# EasyEDA schematic ESP32.json

## Sheets
1 Sheet_1: TITLE: Sheet_1; REV: 1.0; Date: 2024-03-06; Sheet: 1/1; Drawn By: javiervolpe; Company: Your Company
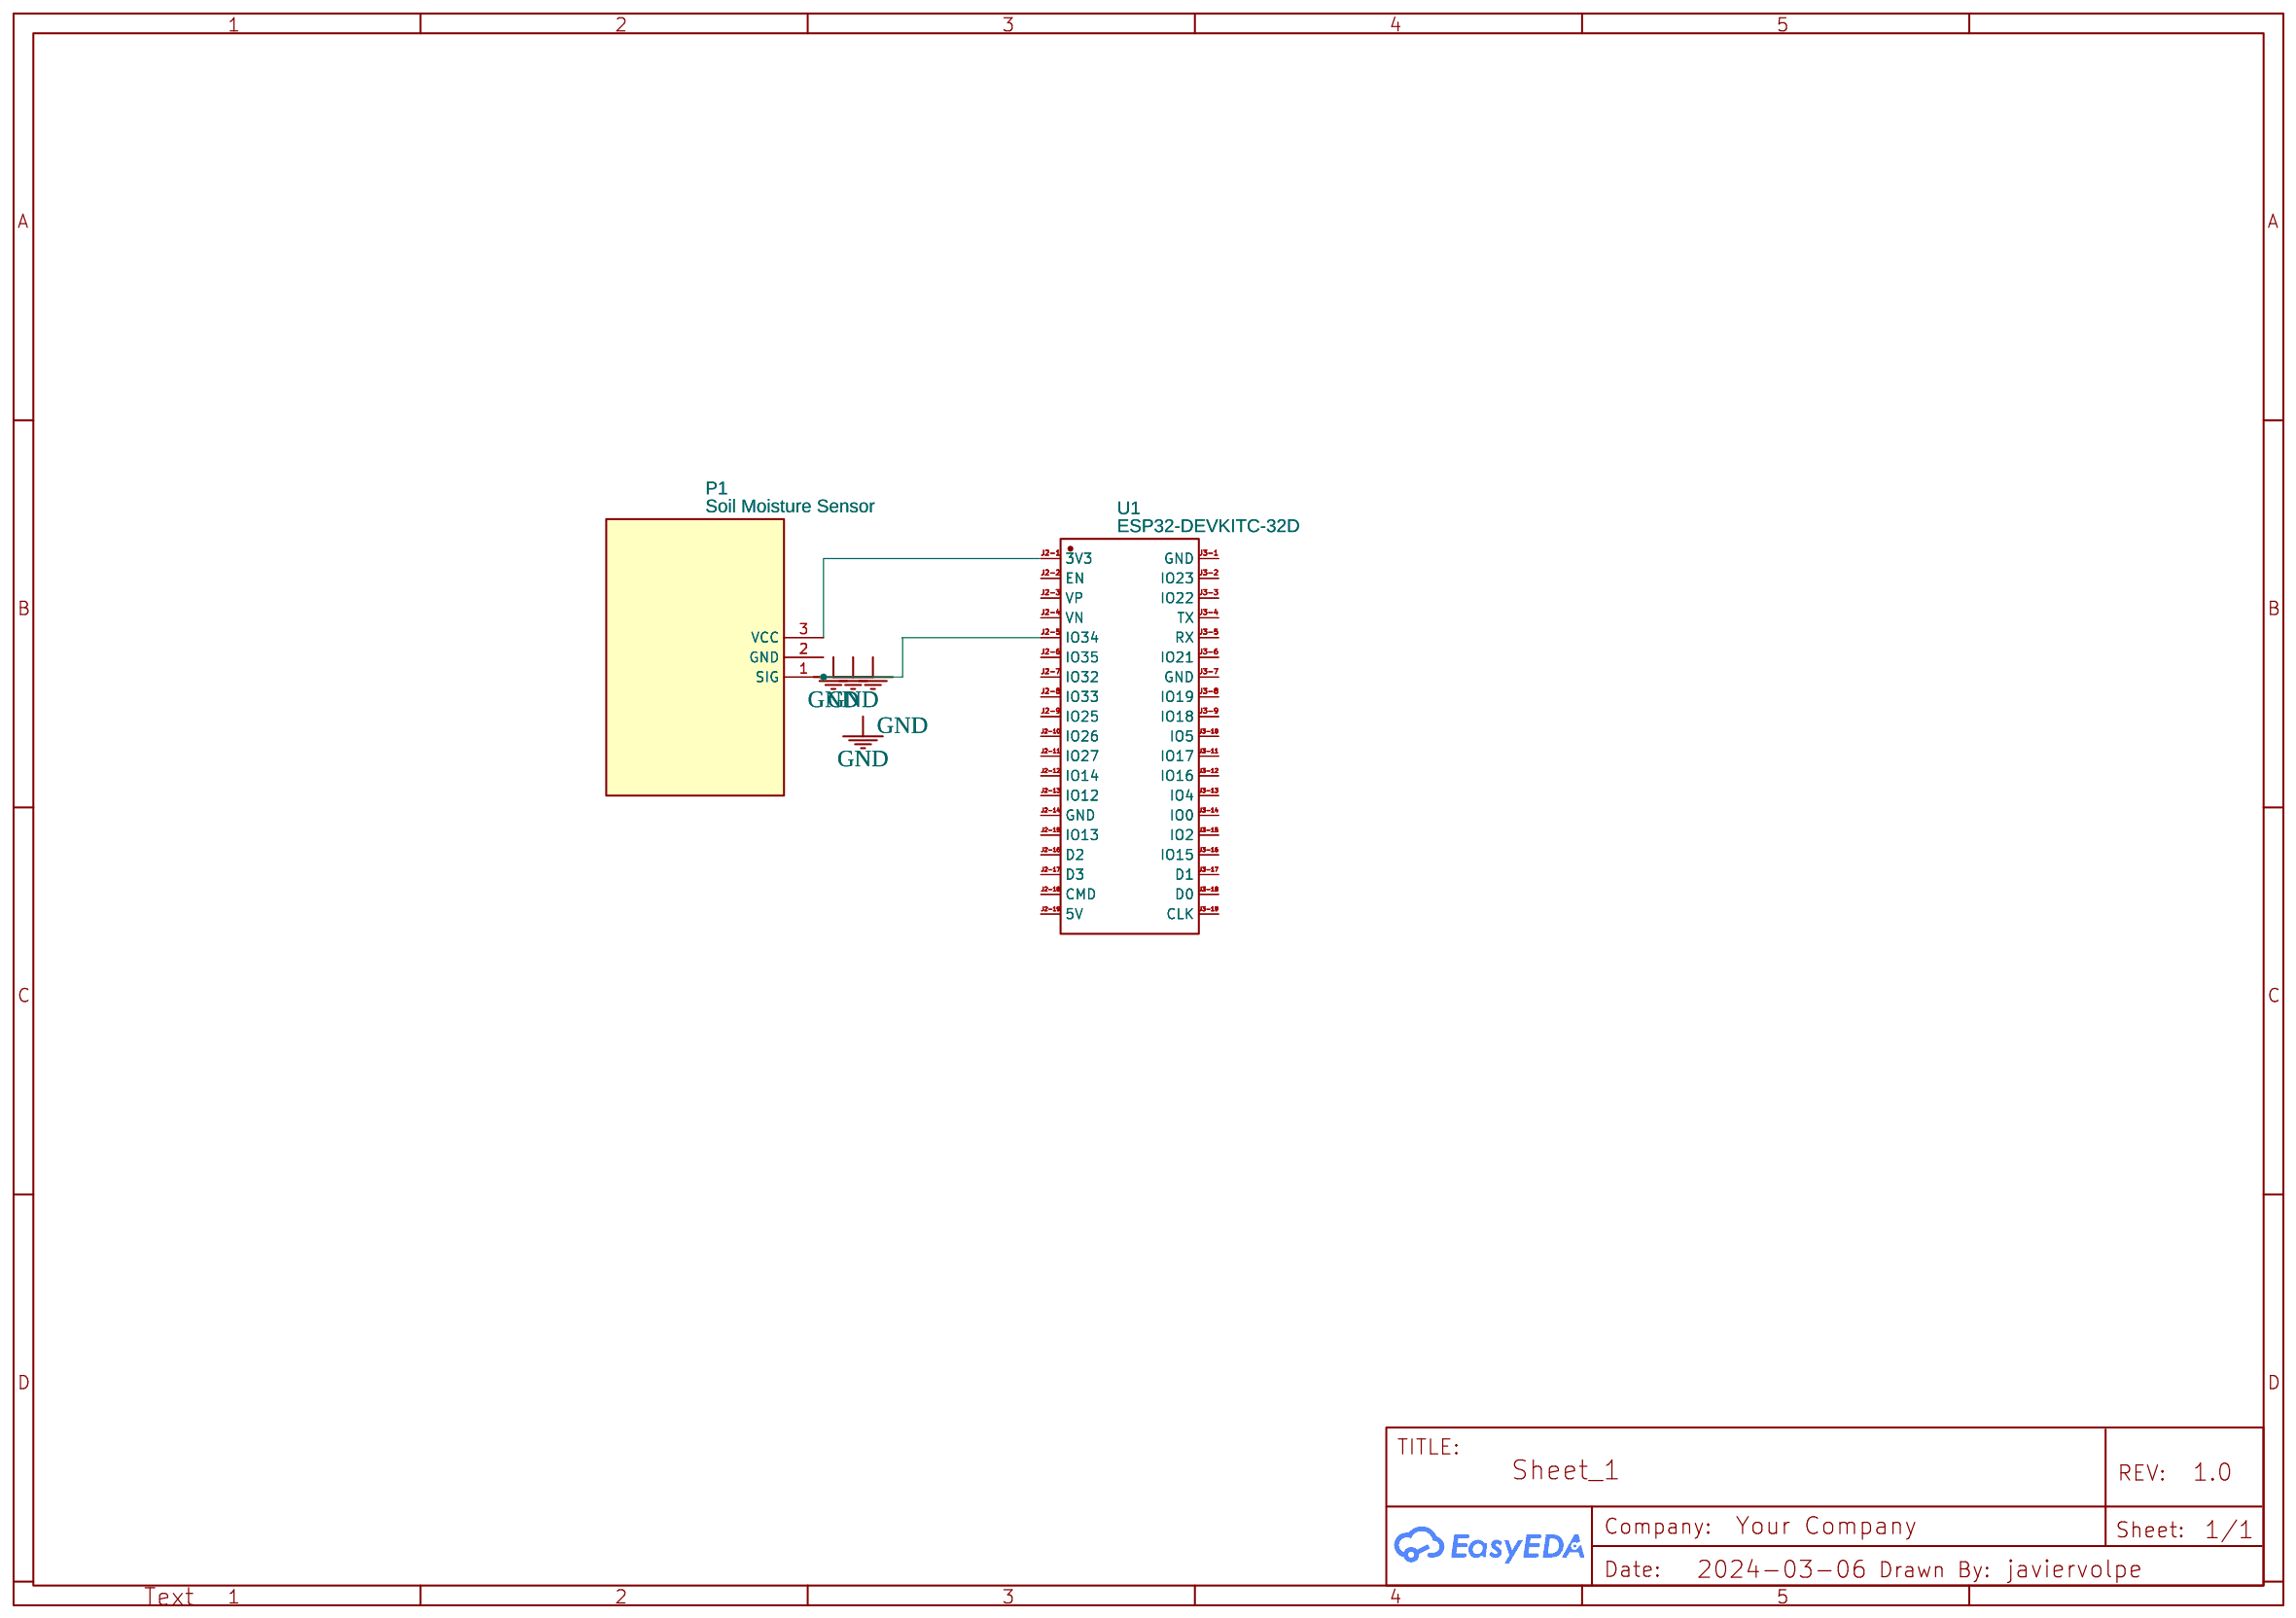
[diagram p0: Sheet_1]
2 Sheet_1#2: TITLE: Armbaand v1; Date: 2024-12-04; Company: KEA
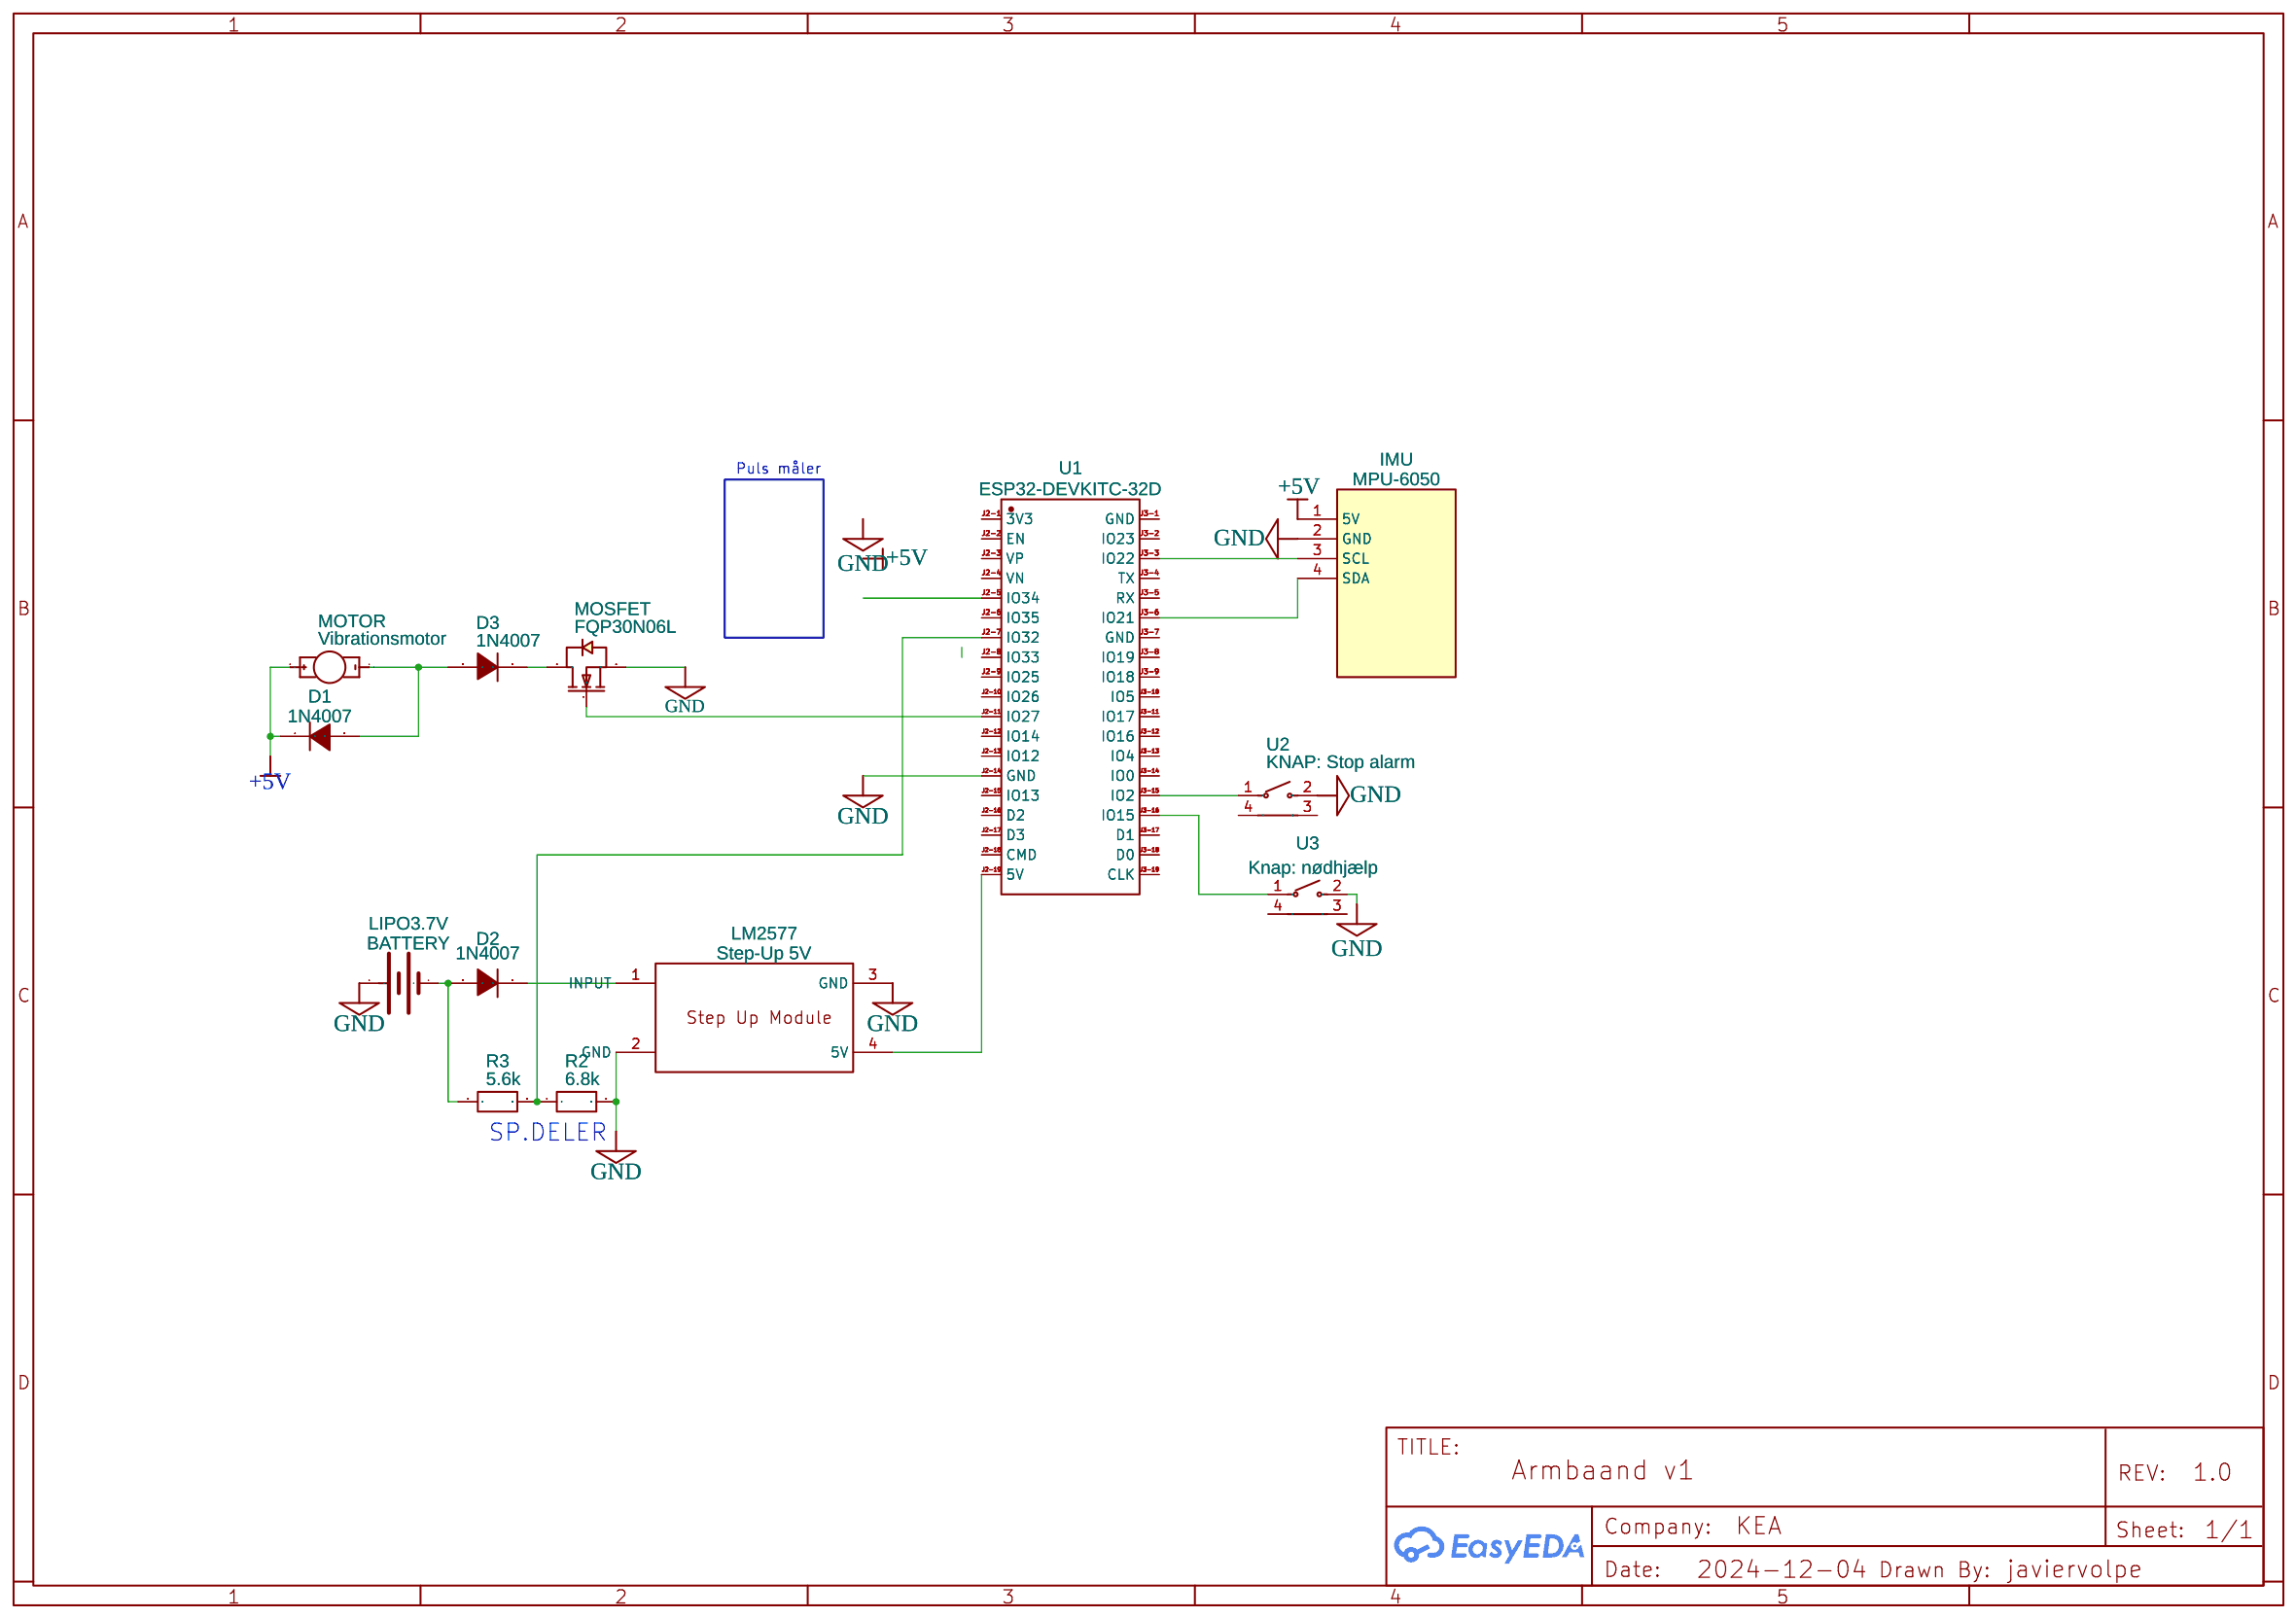
[diagram p1: Sheet_1#2]

## Parts
sheet Sheet_1#2
D1  1N4007  [DO-41_BD2.4-L4.7-P8.70-D0.9-RD]
D2  1N4007  [DO-41_BD2.4-L4.7-P8.70-D0.9-RD]
D3  1N4007  [DO-41_BD2.4-L4.7-P8.70-D0.9-RD]
IMU  MPU-6050  [MPU6050]
LIPO3.7V  BATTERY  [BATTERY]
LM2577  Step-Up 5V
MOSFET  FQP30N06L  [TO-220AB-3_L10.2-W4.6-P2.54-L]
MOTOR  Vibrationsmotor  [VIBE-MOTOR-10MM]
R2  6.8k  [R0603]
R3  5.6k  [R0603]
U1#2  ESP32-DEVKITC-32D  [COMM-SMD_ESP32-DEVKITC-32D]
U2  KNAP: Stop alarm  [SW-SMD_L4.7-W3.5-P3.35-EH]
U3  Knap: nødhjælp  [SW-SMD_L4.7-W3.5-P3.35-EH]
sheet Sheet_1
P1  Soil Moisture Sensor  [SOIL MOISTURE SENSOR]
U1  ESP32-DEVKITC-32D  [COMM-SMD_ESP32-DEVKITC-32D]

## Library data of the parts
D1-D3 = 1N4007: Supplier: LCSC; Manufacturer: ST(先科); Supplier Part: C106903; JLCPCB Part Class: Extended Part
IMU = wildanv2: sourceId: 1T5FDZYC8; Supplier: Aliexpress; Contributor: wildan.iswahyudi.2105366
LIPO3.7V = BATTERY: Contributor: SparkFun
LM2577 = Step-Up 5V: Contributor: dinopalazzi
MOSFET = FQP30N06L_C243087: Contributor: lcsc; Supplier: LCSC; Supplier Part: C243087; Manufacturer: onsemi(安森美); JLCPCB Part Class: Extended Part
MOTOR = MOTOR10MM: Vibration Motor- ROB-08449; Contributor: SparkFun
R2 R3 = R_0603_EU: Contributor: LCEDA_Lib
U1 U1#2 = ESP32-DEVKITC-32D: Supplier: LCSC; Supplier Part: C571181; Manufacturer: ESPRESSIF(乐鑫); Manufacturer Part: ESP32-DevKitC-32D; JLCPCB Part Class: Extended Part; Contributor: javiervolpe
U2 U3 = KEY1PUSH: Contributor: lcsc; Supplier: LCSC; Supplier Part: C9900015021; Manufacturer: null; Manufacturer Part: key1push; JLCPCB Part Class: Extended Part
P1 = Soil Moisture Sensor: sourceId: i6oizRL3l; Supplier Part: 12587; Supplier: SparkFun

## Nets
+5V: D1.1(K) IMU.1(5V) MOTOR.+
GND: IMU.2(GND) LIPO3.7V.+ LM2577.3(GND) MOSFET.3(S) R2.2 U1#2.J2-14(GND) U2.2 U3.2
Net-(D1-2): D1.2(A) D3.2(A) MOTOR.-
Net-(D2-2): D2.2(A) LIPO3.7V.- R3.1
Net-(D3-1): D3.1(K) MOSFET.2(D)
Net-(IMU-3): IMU.3(SCL) U1#2.J3-3(IO22)
Net-(IMU-4): IMU.4(SDA) U1#2.J3-6(IO21)
Net-(LM2577-4): LM2577.4(5V) U1#2.J2-19(5V)
Net-(MOSFET-1): MOSFET.1(G) U1#2.J2-11(IO27)
Net-(P1-1): P1.1(SIG) U1.J2-5(IO34)
Net-(P1-3): P1.3(VCC) U1.J2-1(3V3)
Net-(R2-1): R2.1 R3.2 U1#2.J2-7(IO32)
Net-(U1#2-J3-15): U1#2.J3-15(IO2) U2.1
Net-(U1#2-J3-16): U1#2.J3-16(IO15) U3.1

Not connected (* = marked no-connect by the designer): D2 1(K); LM2577 1(INPUT) 2(GND); P1 2(GND); U1 J2-2(EN) J2-3(VP) J2-4(VN) J2-6(IO35) J2-7(IO32) J2-8(IO33) J2-9(IO25) J2-10(IO26) J2-11(IO27) J2-12(IO14) J2-13(IO12) J2-14(GND) J2-15(IO13) J2-16(D2) J2-17(D3) J2-18(CMD) J2-19(5V) J3-1(GND) J3-2(IO23) J3-3(IO22) J3-4(TX) J3-5(RX) J3-6(IO21) J3-7(GND) J3-8(IO19) J3-9(IO18) J3-10(IO5) J3-11(IO17) J3-12(IO16) J3-13(IO4) J3-14(IO0) J3-15(IO2) J3-16(IO15) J3-17(D1) J3-18(D0) J3-19(CLK); U1#2 J2-1(3V3) J2-2(EN) J2-3(VP) J2-4(VN) J2-5(IO34) J2-6(IO35) J2-8(IO33) J2-9(IO25) J2-10(IO26) J2-12(IO14) J2-13(IO12) J2-15(IO13) J2-16(D2) J2-17(D3) J2-18(CMD) J3-1(GND) J3-2(IO23) J3-4(TX) J3-5(RX) J3-7(GND) J3-8(IO19) J3-9(IO18) J3-10(IO5) J3-11(IO17) J3-12(IO16) J3-13(IO4) J3-14(IO0) J3-17(D1) J3-18(D0) J3-19(CLK); U2 3 4; U3 3 4

## Notes on the sheets
sheet 2
- Puls måler
- SP.DELER
